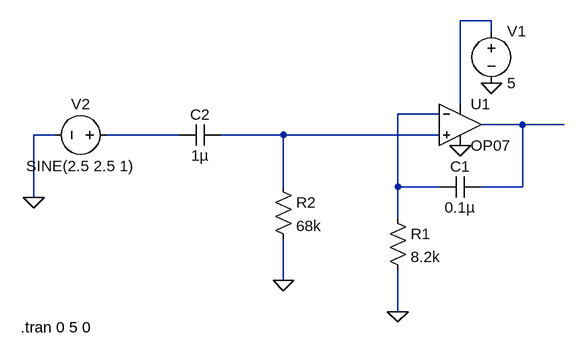
[diagram p0: schematic Op-Amp1.asc]
Op-Amp1.asc, the LTspice schematic file:
Version 4
SHEET 1 880 680
WIRE 192 -64 144 -64
WIRE 192 -48 192 -64
WIRE 144 64 144 -64
WIRE 112 80 48 80
WIRE 240 96 176 96
WIRE 304 96 240 96
WIRE -480 112 -512 112
WIRE -288 112 -400 112
WIRE -128 112 -224 112
WIRE 112 112 -128 112
WIRE -128 192 -128 112
WIRE 48 192 48 80
WIRE 112 192 48 192
WIRE 240 192 240 96
WIRE 240 192 176 192
WIRE -512 208 -512 112
WIRE 48 240 48 192
WIRE -128 336 -128 272
WIRE 48 384 48 320
FLAG 144 128 0
FLAG 48 384 0
FLAG -128 336 0
FLAG 192 32 0
FLAG -512 208 0
SYMBOL Opamps\\OP07 144 32 R0
SYMATTR InstName U1
SYMBOL cap 176 176 R90
WINDOW 0 0 32 VBottom 2
WINDOW 3 32 32 VTop 2
SYMATTR InstName C1
SYMATTR Value 0.1µ
SYMBOL res -144 176 R0
SYMATTR InstName R2
SYMATTR Value 68k
SYMBOL res 32 224 R0
SYMATTR InstName R1
SYMATTR Value 8.2k
SYMBOL voltage 192 -64 R0
WINDOW 123 0 0 Left 0
WINDOW 39 0 0 Left 0
SYMATTR InstName V1
SYMATTR Value 5
SYMBOL voltage -384 112 R90
WINDOW 0 -32 56 VBottom 2
WINDOW 3 32 56 VTop 2
WINDOW 123 0 0 Left 0
WINDOW 39 0 0 Left 0
SYMATTR InstName V2
SYMATTR Value SINE(2.5 2.5 1)
SYMBOL cap -224 96 R90
WINDOW 0 0 32 VBottom 2
WINDOW 3 32 32 VTop 2
SYMATTR InstName C2
SYMATTR Value 1µ
TEXT -532 408 Left 2 !.tran 0 5 0

The netlist it stands for:
* Op-Amp1.asc
XU1 N005 N002 N001 0 N003 LT1001  ; OP07, pins In+ In- V+ V- OUT
C1 N003 N002 0.1µ
R2 N005 0 68k
R1 N002 0 8.2k
V1 N001 0 5
V2 N004 0 SINE(2.5 2.5 1)
C2 N005 N004 1µ
.tran 0 5 0
.lib LTC.lib
.backanno
.end